# Altium schematic sheet BATTERY.SchDoc
size A4; SheetNumber: 3; SheetTotal: 7
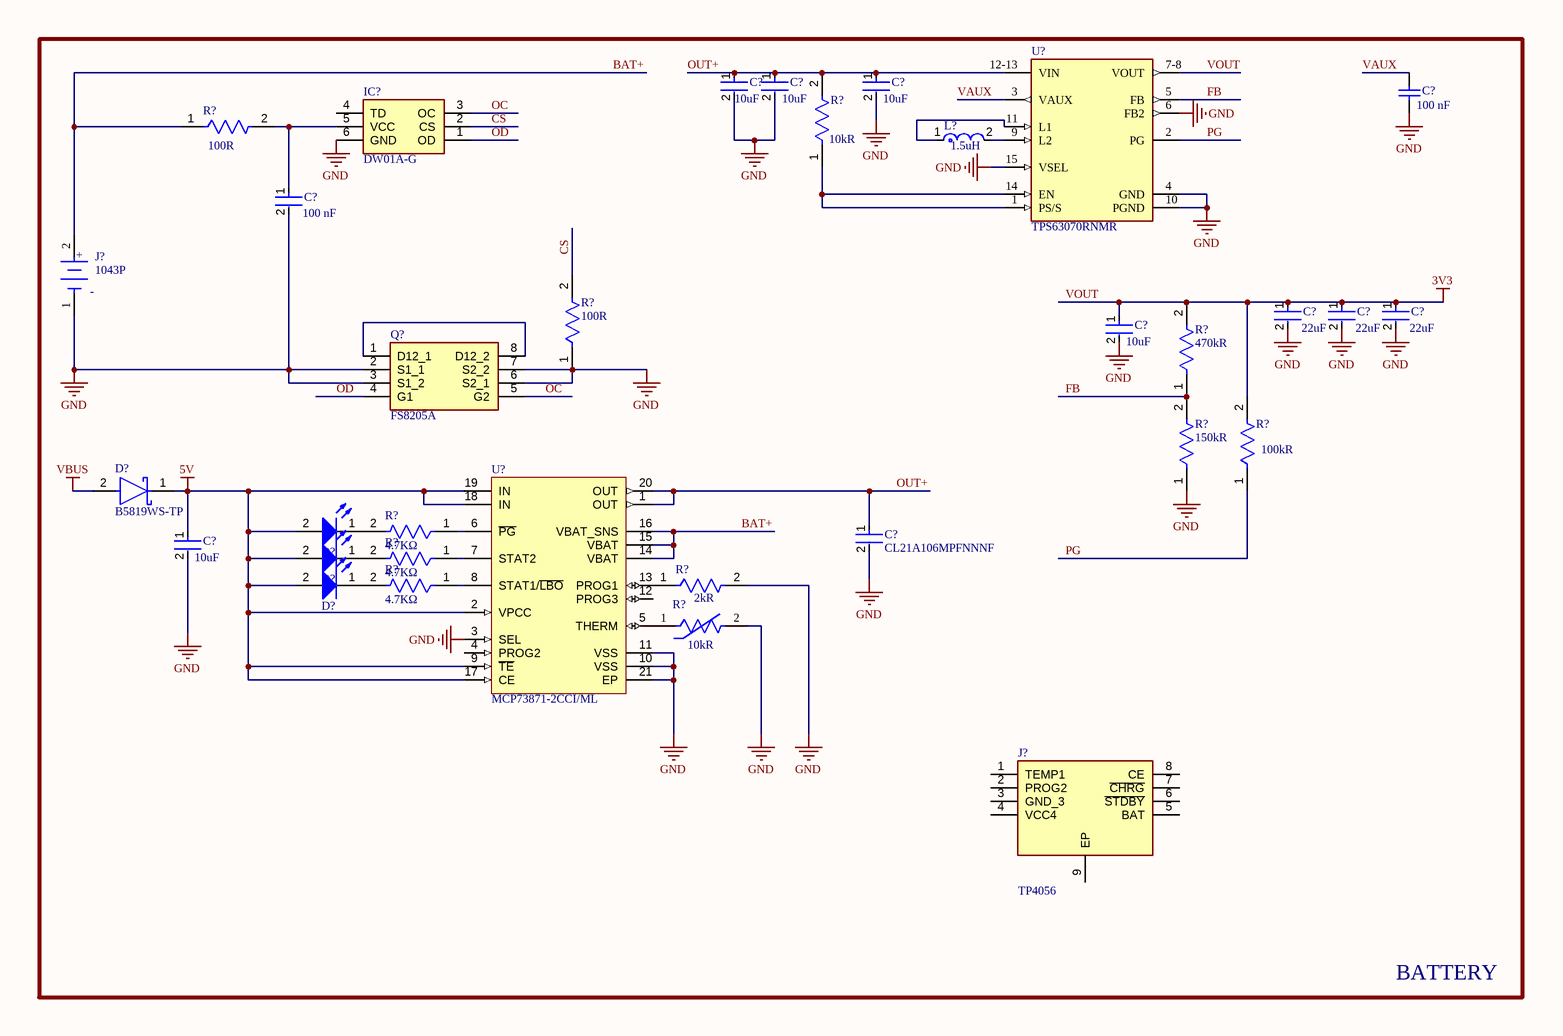
[diagram p0: BATTERY.SchDoc]

## Parts
(Parts that share a designator on the sheet are numbered #1, #2 ... from top to bottom, then left to right.)
C?#1  Capacitance: 10uF  [FP-CL21-IPC_C]  (hidden comment: CL21A106MPFNNNF)
C?#2  Capacitance: 10uF  [FP-CL21-IPC_C]  (hidden comment: CL21A106MPFNNNF)
C?#3  Capacitance: 10uF  [FP-CL21-IPC_C]  (hidden comment: CL21A106MPFNNNF)
C?#4  value 100 nF  [CAPC1005X56X25LL10T15]  (hidden comment: 0402ZD104JAT2A)
C?#5  value 100 nF  [FP-CC0805-0_85-MFG]  (hidden comment: CC0805KRX7R8BB104)
C?#6  Capacitance: 22uF  [FP-CL21-IPC_B]  (hidden comment: CL21A226MQCLQNC)
C?#7  Capacitance: 22uF  [FP-CL21-IPC_B]  (hidden comment: CL21A226MQCLQNC)
C?#8  Capacitance: 22uF  [FP-CL21-IPC_B]  (hidden comment: CL21A226MQCLQNC)
C?#9  Capacitance: 10uF  [FP-CL21-IPC_C]  (hidden comment: CL21A106MPFNNNF)
C?#10  CL21A106MPFNNNF  [FP-CL21-IPC_C]
C?#11  Capacitance: 10uF  [FP-CL21-IPC_C]  (hidden comment: CL21A106MPFNNNF)
D?#1  B5819WS-TP  [FP-SOD-323-IPC_C]
D?#2  150080BS75000  [WL-SMCW_0805_150080xx75000]  (value not drawn)
D?#3  150080BS75000  [WL-SMCW_0805_150080xx75000]  (value not drawn)
D?#4  150080BS75000  [WL-SMCW_0805_150080xx75000]  (value not drawn)
IC?  DW01A-G  [SOT95P190X145-6N]
J?#1  1043P  [FP-1043P-MFG]
J?#2  TP4056  [SOIC127P600X175-9N]
L?  Inductance: 1.5uH  [FP-XFL4020-MFG]  (hidden comment: XFL4020-152MEC)
Q?  FS8205A  [SOP65P640X120-8N]
R?#1  Resistance: 100R  [FP-CR0805-IPC_A]  (hidden comment: CR0805-JW-101GLF)
R?#2  Resistance: 10kR  [FP-CRCW1206-e3-IPC_C]  (hidden comment: CRCW120610K0FKEA)
R?#3  Resistance: 100R  [FP-CR0805-IPC_A]  (hidden comment: CR0805-JW-101GLF)
R?#4  Resistance: 470kR  [FP-CR0805-IPC_A]  (hidden comment: CR0805-JW-474GLF)
R?#5  Resistance: 150kR  [FP-MCU0805-IPC_B]  (hidden comment: MCU08050C1503FP500)
R?#6  Resistance: 100kR  [FP-CR0805-MFG]  (hidden comment: CR0805-JW-104GLF)
R?#7  value 4.7KΩ  [FP-RT0805-MFG]  (hidden comment: RT0805DRE074K7L)
R?#8  value 4.7KΩ  [FP-RT0805-MFG]  (hidden comment: RT0805DRE074K7L)
R?#9  value 4.7KΩ  [FP-RT0805-MFG]  (hidden comment: RT0805DRE074K7L)
R?#10  Resistance: 2kR  [FP-MCR10-MFG]  (hidden comment: MCR10EZHJ202)
R?#11  Resistance: 10kR  [FP-ERTJ1-MFG]  (hidden comment: ERT-J1VG103FA)
U?#1  TPS63070RNMR  [FP-RNM0015A-MFG]
U?#2  MCP73871-2CCI/ML  [QFN-ML20_M]

## Nets
5V: C?#11.1 D?#1.1(C) D?#2.2(A) D?#3.2(A) D?#4.2(A) U?#2.2(VPCC) U?#2.9(~{TE}) U?#2.17(CE) U?#2.18(IN) U?#2.19(IN)
GND: C?#1.2 C?#2.2 C?#3.2 C?#4.1 C?#5.2 C?#6.2 C?#7.2 C?#8.2 C?#9.2 C?#10.2 C?#11.2 IC?.6(GND) J?#1.1(C) Q?.2(S1_1) Q?.3(S1_2) Q?.6(S2_1) Q?.7(S2_2) R?#3.1 R?#5.1 R?#10.2 R?#11.2 U?#1.4(GND) U?#1.6(FB2) U?#1.10(PGND) U?#1.15(VSEL) U?#2.3(SEL) U?#2.10(VSS) U?#2.11(VSS) U?#2.21(EP)
VBUS: D?#1.2(A)
VOUT: C?#6.1 C?#7.1 C?#8.1 C?#9.1 R?#4.2 R?#6.2 U?#1.7-8(VOUT)  [also labelled 3V3]
BAT+: J?#1.2(A) R?#1.1 U?#2.14(VBAT) U?#2.15(VBAT) U?#2.16(VBAT_SNS)
CS: IC?.2(CS) R?#3.2
FB: R?#4.1 R?#5.2 U?#1.5(FB)
OC: IC?.3(OC) Q?.5(G2)
OD: IC?.1(OD) Q?.4(G1)
OUT+: C?#1.1 C?#2.1 C?#3.1 C?#10.1 R?#2.2 U?#1.12-13(VIN) U?#2.1(OUT) U?#2.20(OUT)
PG: R?#6.1 U?#1.2(PG)
VAUX: C?#4.2 U?#1.3(VAUX)
NetC?#5_1: C?#5.1 IC?.5(VCC) R?#1.2
NetD?#2_1: D?#2.1(K) R?#7.2
NetD?#3_1: D?#3.1(K) R?#8.2
NetD?#4_1: D?#4.1(K) R?#9.2
NetL?_1: L?.1 U?#1.11(L1)
NetL?_2: L?.2 U?#1.9(L2)
NetQ?_1: Q?.1(D12_1) Q?.8(D12_2)
NetR?#2_1: R?#2.1 U?#1.1(PS/S) U?#1.14(EN)
NetR?#7_1: R?#7.1 U?#2.6(~{PG})
NetR?#8_1: R?#8.1 U?#2.7(STAT2)
NetR?#9_1: R?#9.1 U?#2.8(STAT1/~{LBO})
NetR?#10_1: R?#10.1 U?#2.13(PROG1)
NetR?#11_1: R?#11.1 U?#2.5(THERM)

Not connected (* = marked no-connect by the designer): IC? 4(TD); J?#2 1(TEMP1) 2(PROG2) 3(GND_3) 4(VCC4) 5(BAT) 6(~{STDBY}) 7(~{CHRG}) 8(CE) 9(EP); U?#2 4(PROG2) 12(PROG3)

## Notes on the sheet
- BATTERY
- DWG. NO.
- REV.
- SHT.
- THIS DOCUMENT AND THE DATA DISCLOSED HEREIN OR HEREWITH IS THE PROPERTY OF ALTIUM LIMITED AND MAY BE FREELY DISTRIBUTED IN WHOLE. NO RIGHTS ARE RESERVED OR EXPRESS OR IMPLIED WARANTEE GIVEN.
- REVISION
- DESCRIPTION
- DATE
- APPROVED
- ENG:
- APPROVALS
- PROJECT
- DSN:
- CHK:
- REFERENCE DOCUMENTS
- PROJECT REVISION:
- TITLE
- DOCUMENT REVISION:
- DESIGN ITEM:
- BOM:
- FAB DWG:
- PCB DWG:
- ASSY DWG:
- SCALE:
- SIZE
- B
- CAGE CODE
- FILE NAME
- DWG NO.
- SHEET
- OF
- REV
- (in symbol CMP-19636-000034-1) +

## Library data of the parts
C?#1-C?#3 C?#9-C?#11 = CMP-13271-002245-1: CL21 Series 0805 10uF 10V ±20% Tolerance X5R Multilayer Ceramic Chip Capacitor; Voltage Rating (DC): 10V; Mount: Surface Mount; Tolerance: 20%; Case/Package: 0805; Voltage Rating: 10V; Dielectric: X5R; Max Operating Temperature: 85°C; Packaging: Tape and Reel; Height: 1.25mm; Thickness: 0.053inch; Width: 0.049inch; Length: 2mm; Radiation Hardening: No; Min Operating Temperature: -55°C; Depth: 1.25mm; Package Quantity: 10000
  C?#10: Capacitance: 10uF
C?#4 = CMP-2008-02899-1: Manufacturer: AVX Interconnect / Elco; Part Number: 0402ZD104JAT2A
C?#5 = CMP-1036-04410-2: CAP CER 0.1UF 25V X7R 0805; Manufacturer: Yageo; Tolerance: 0.1; Material: Ceramic; ComponentLink2URL: http://www.yageo.com/documents/recent/UPY-GPHC_Y5V_6.3V-to-50V_8.pdf; Category: Cap; Mouser Description: Multilayer Ceramic Capacitors MLCC - SMD/SMT 100nF 25V X7R 10%; Manufacturer Part Number: CC0805KRX7R8BB104; Device Class L1: Passive Components; Footprint Url: http://www.yageo.com/exep/pages/download/literatures/UPY-C_GEN_24.pdf; Height: 0.95mm; Digikey Description: CAP CER 0.1UF 25V X7R 0805; Lead Free: Yes; Temperature Range High: +85°C; Temperature: -30°C to +85°C; Ipc Land Pattern Name: CAPC200125X85; Capacitance: 100 nF; Automotive: No; Octopart: https://octopart.com/cc0805krx7r8bb104-yageo-39467766; Device Class L2: Capacitors; Temperature Characteristic: X7R; Voltage Rating: 25 V; ComponentLink2Description: Datasheet; Temperature Range Low: -30°C; Device Class L3: Ceramic Capacitors; RoHS: TRUE; Package: CC0805-0.85
C?#6-C?#8 = CMP-13271-001454-1: CL21 Series 0805 22uF 6.3V ±20% Tolerance X5R Multilayer Ceramic Chip Capacitor; Mount: Surface Mount; Voltage Rating: 6.3V; Radiation Hardening: No; Thickness: 0.037inch; Packaging: Tape and Reel; Width: 0.049inch; Tolerance: 20%; Case Code (Imperial): 0805; Dielectric: X5R; Case Code (Metric): 2012; Package Quantity: 1; Lead Free: Lead Free; Case/Package: 0805; Min Operating Temperature: -55°C; Depth: 1.25mm; Length: 2mm; Height: 0.85mm; Max Operating Temperature: 85°C
D?#1 = CMP-56206-000009-1: DIODE SCHOTTKY 40V 1A SOD323; Max Reverse Leakage Current: 1mA; Peak Non-Repetitive Surge Current: 10A; Forward Voltage: 900mV; Element Configuration: Single; Max Reverse Voltage (DC): 40V; Number of Pins: 2; Max Operating Temperature: 125°C; Package Quantity: 1; Radiation Hardening: No; Average Rectified Current: 1A; Lead Free: Lead Free; Series: -; Mount: Surface Mount; Min Operating Temperature: -65°C; RoHS Compliant: Yes; Packaging: Tape and Reel; Max Surge Current: 10A
D?#2-D?#4 = CMP-1426-00008-7: Led, Blue, 470 Nm, 3.2 V, 30 Ma, 145 Mcd Rohs Compliant: Yes; Dominant Wavelength: 470nm; Max Junction Temperature (Tj): 95°C; Power Dissipation: 105mW; Peak Wavelength: 465nm; Max Reverse Voltage (DC): 5V; Forward Current: 100mA; Test Current: 20mA; Luminous Intensity: 145mcd; Lens Style: Clear, Rectangular; Viewing Angle: 140°; Forward Voltage: 3.2V; Color: Blue; Height: 700µm; Case Code (Imperial): 0805; Width: 1.25mm; REACH SVHC: Unknown; Case/Package: 0805; Lead Free: Lead Free; Mount: Surface Mount; Packaging: Tape and Reel; RoHS: Compliant; Reverse Voltage: 5V; Min Operating Temperature: -40°C; Case Code (Metric): 2012; Wavelength: 470nm; Max Operating Temperature: 85°C; Length: 2mm
IC? = DW01A-G: Integrated Circuit; Manufacturer_Name: SII Semiconductor; Datasheet Link: http://www.ic-fortune.com/upload/Download/DW01x-DS-17_EN.pdf; Height: 1.45mm; Manufacturer_Part_Number: DW01A-G
J?#1 = CMP-19636-000034-1: BATT HOLDER 18650 1 CELL PC PIN; Number of Cells: 1; Series: -; Termination: PC Pin; Package Quantity: 50; Min Operating Temperature: -50°C; Mount: Through Hole; Packaging: Tray; Max Operating Temperature: 145°C
J?#2 = TP4056: Connector; Manufacturer_Name: NanJing Top Power; Datasheet Link: https://dlnmh9ip6v2uc.cloudfront.net/datasheets/Prototyping/TP4056.pdf; Height: 1.75mm; Manufacturer_Part_Number: TP4056
L? = CMP-11268-000104-1: Inductor Power Shielded Wirewound 1.5uH 20% 100KHz 9.1A 15.8mOhm DCR 1515 Automotive Embossed Plastic T/R; Core Material: Composite; DC Resistance (DCR): 15.8mR; Saturation Current: 4.1A; Self Resonant Frequency: 59MHz; Tolerance: 20%; Max DC Current: 9.1A; RoHS Compliant: Yes; Max Operating Temperature: 125°C; Length: 4.3mm; Case/Package: SMD/SMT; Mount: Surface Mount; Shielding: Shielded; Min Operating Temperature: -40°C; RMS Current (Irms): 9.1A; Test Frequency: 100kHz; Inductance Tolerance: 20%; REACH SVHC: No SVHC; Packaging: Tape and Reel; Termination: SMD/SMT; Lead Free: Contains Lead; Width: 4.3mm; Series: XFL4020; Height: 2.1mm
Q? = FS8205A: Transistor; Manufacturer_Name: SII Semiconductor; Datasheet Link: http://www.ic-fortune.com/upload/Download/FS8205A-DS-12_EN.pdf; Height: 1.2mm; Manufacturer_Part_Number: FS8205A
R?#1 R?#3 = CMP-07231-005410-1: Thick Film Chip Resistors 0805 100Ω 0.125W 5% 200ppm/°C; Voltage Rating: 150V; Max Power Dissipation: 125mW; Composition: Thick Film; Height: 0.024inch; Mount: Surface Mount; Min Operating Temperature: -55°C; Case/Package: 0805; Depth: 1.25mm; Number of Terminations: 2; Features: Moisture Resistant; Thickness: 508um; Temperature Coefficient: 200ppm/°C; Contact Plating: Tin; Length: 0.079inch; Max Operating Temperature: 155°C; Tolerance: 5%; Case Code (Metric): 2012; Width: 0.049inch; Case Code (Imperial): 0805; Power Rating: 125mW; Packaging: Tape and Reel; Termination: SMD/SMT; Package Quantity: 10000; Radiation Hardening: No; Military Standard: Not
R?#2 = CMP-2003-04807-2: RES Thick Film, 10kΩ, 1%, 0.25W, 100ppm/°C, 1206; Working Voltage: 200V; Max Power Dissipation: 250mW; Tolerance: 1%; Width: 0.063inch; Height: 0.55mm; Number of Pins: 2; Voltage Rating: 200V; Temperature Coefficient: 100ppm/°C; Military Standard: Not; Features: Automotive AEC-Q200; Depth: 1.6mm; Radiation Hardening: No; Termination: SMD/SMT; Case Code (Imperial): 1206; Weight: 0.000353oz; Length: 3.2mm; Package Quantity: 10; Voltage Rating (DC): 200V; Case/Package: 1206; Min Operating Temperature: -55°C; Number of Terminations: 2; Composition: Thick Film; Contact Plating: Tin; Power Rating: 250mW; Packaging: Tape and Reel; Max Operating Temperature: 155°C; Lead Free: Lead Free; Case Code (Metric): 3216
R?#4 = CMP-07231-006605-1: Thick Film Chip Resistors 0805 470kΩ 0.125W 5% 200ppm/°C; Max Power Dissipation: 125mW; Voltage Rating: 150V; Radiation Hardening: No; Construction: Rectangular; Width: 0.049inch; Termination: SMD/SMT; Packaging: Tape and Reel; Min Operating Temperature: -55°C; Series: CR0805; Contact Plating: Tin; Tolerance: 5%; Power Rating: 125mW; Weight: 0.000194oz; Number of Terminations: 2; Package Quantity: 10000; Max Operating Temperature: 155°C; Case Code (Metric): 2012; Case/Package: 0805; Features: Moisture Resistant; Temperature Coefficient: 200ppm/°C; Depth: 1.25mm; Mount: Surface Mount; Thickness: 508um; Military Standard: Not; Length: 2mm; Case Code (Imperial): 0805; Height: 0.024inch; Resistor Type: Thick Film
R?#5 = CMP-02407-003613-1: RES 1.05K OHM 0.5% 1/5W 0805; Max Power Dissipation: 200mW; Temperature Coefficient: 50ppm/°C; Tolerance: 1%; Military Standard: Not; Packaging: Tape and Reel; Length: 0.079inch; Max Operating Temperature: 125°C; Case/Package: 0805; Min Operating Temperature: -55°C; Width: 0.049inch; Composition: Thin Film; Number of Terminations: 2; Radiation Hardening: No; Package Quantity: 5000; Lead Free: Lead Free; Contact Plating: Tin; Depth: 1.25mm; Height: 0.022inch
R?#6 = CMP-07231-001707-1: Thick Film Chip Resistors 0805 100kΩ 0.125W 5% 200ppm/°C; Power Rating: 125mW; Voltage Rating: 150V; Case Code (Metric): 2012; Case Code (Imperial): 0805; Temperature Coefficient: 200ppm/°C; Mount: Surface Mount; Tolerance: 5%; Radiation Hardening: No; Military Standard: Not; Contact Plating: Tin; Number of Terminations: 2; Packaging: Tape and Reel; Thickness: 508um; Length: 0.079inch; Depth: 1.25mm; Min Operating Temperature: -55°C; Features: Moisture Resistant; Max Operating Temperature: 155°C; Width: 0.049inch; Package Quantity: 10000; Termination: SMD/SMT; Composition: Thick Film; Max Power Dissipation: 125mW; Height: 0.024inch; Case/Package: 0805
R?#7-R?#9 = CMP-03412-005354-1: RES SMD 4.7K OHM 0.5% 1/8W 0805; Manufacturer: Yageo; Power Rating: 0.125W; Tolerance: 0.01; Voltage Rating: 150V; Temperature Coefficient: 50 ppm/°C; Lead Free: Yes; Device Class L2: Resistors; ComponentLink2Description: Datasheet; RoHS: TRUE; Package: RT0805; Resistance: 4.7KΩ; Device Class L3: Chip SMD Resistors; Ipc Land Pattern Name: RESC200125X50; Category: Res; Octopart: https://octopart.com/rt0805dre074k7l-yageo-1242027; Temperature: -55°C to +155°C; Temperature Range High: +155°C; Digikey Description: RES SMD 4.7K OHM 0.5% 1/8W 0805; Series: RT; Height: 0.6mm; Footprint Url: http://www.yageo.com/exep/pages/download/literatures/PYu-R_Mount_10.pdf; Device Class L1: Passive Components; Temperature Range Low: -55°C; Composition: Thin Film; Manufacturer Part Number: RT0805DRE074K7L; ComponentLink2URL: http://www.yageo.com/documents/recent/PYu-RT_1-to-0.01_RoHS_L_9.pdf; Automotive: No
R?#10 = CMP-08839-010481-1: Thick Film Chip Resistor, 0805, 2kΩ, 5%, 200ppm/°C, 0.125W, 150V; Max Power Dissipation: 125mW; Height: 0.024inch; Max Operating Temperature: 155°C; Temperature Coefficient: 200ppm/°C; Mount: Surface Mount; Contact Plating: Tin; Voltage Rating (DC): 150V; Power Rating: 125mW; Number of Terminations: 2; Case Code (Metric): 2012; Package Quantity: 5000; Size Code: 0805; Lead Free: Lead Free; Case Code (Imperial): 0805; Tolerance: 5%; Resistor Type: Thick Film; Width: 0.049inch; Length: 0.079inch; Case/Package: 0805; Packaging: Tape and Reel; Radiation Hardening: No; Series: MCR10; Min Operating Temperature: -55°C; RoHS Compliant: Yes
R?#11 = CMP-05419-000001-1: THERMISTOR NTC 10KOHM 3380K 0603; Max Power Dissipation: 100mW; Resistance Tolerance: 1%; Case Code (Imperial): 0603; Height: 0.8mm; Case/Package: 0603; Depth: 0.8mm; Min Operating Temperature: -40°C; Accuracy: 1%; Series: ERT-J; Termination: SMD/SMT; Length: 1.6mm; Number of Pins: 2; Lead Free: Lead Free; Power Rating: 100mW; Package Quantity: 4000; RoHS Compliant: Yes; Max Operating Temperature: 125°C; Width: 800um; REACH SVHC: No SVHC; Packaging: Tape and Reel; Tolerance: 1%; Mount: Surface Mount; Case Code (Metric): 1608; Radiation Hardening: No
U?#1 = CMP-04918-000409-1: IC REG BCK BST ADJ 3.6A 15VQFN; Synchronous Rectifier: Yes; Output Type: Adjustable; Output Current: 2A; Max Input Voltage: 16V; Switching Frequency: 2.4MHz; Min Output Voltage: 2.5V; Output Configuration: Positive; Min Input Voltage: 2V; Topology: Buck-Boost; Number of Outputs: 1; Max Output Voltage: 9V; Quiescent Current: 50uA; Max Operating Temperature: 125°C; Case/Package: VQFN; Number of Pins: 15; RoHS Compliant: Yes; Mount: Surface Mount; Min Operating Temperature: -40°C; Lead Free: Lead Free; Packaging: Tape and Reel
U?#2 = CMP-0133-00005-1: Stand-Alone System Load Sharing and Li-Ion/Li-Polymer Battery Charge Management Controller, 4.2V, 20-Pin QFN, Industrial Temperature; PackageDescription: 20-Lead Plastic Quad Flat, No Lead Package (ML) - 4x4x0.9 mm Body [QFN]; PackageReference: QFN-ML20; PackageVersion: revBB, Aug-2009; DatasheetVersion: revB, May-2009